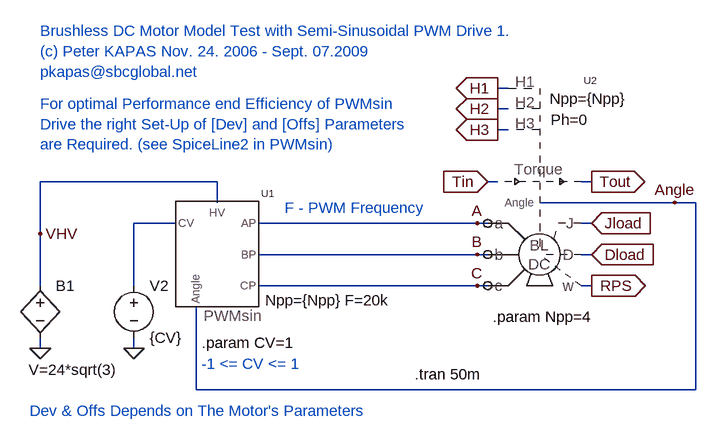
[diagram p0: schematic MotorTest02.asc]
MotorTest02.asc, the LTspice schematic file:
Version 4
SHEET 1 880 804
WIRE 80 -16 64 -16
WIRE 80 16 64 16
WIRE 80 48 64 48
WIRE -368 128 -640 128
WIRE 64 128 48 128
WIRE 208 128 192 128
WIRE -368 160 -368 128
WIRE 336 160 128 160
WIRE 368 160 336 160
WIRE -432 192 -496 192
WIRE 32 192 -304 192
WIRE 48 192 32 192
WIRE 208 192 192 192
WIRE -640 208 -640 128
WIRE 32 240 -304 240
WIRE 48 240 32 240
WIRE 208 240 192 240
WIRE -640 288 -640 208
WIRE -496 288 -496 192
WIRE 32 288 -304 288
WIRE 48 288 32 288
WIRE 208 288 192 288
WIRE -640 384 -640 368
WIRE -496 384 -496 368
WIRE -400 448 -400 320
WIRE 368 448 368 160
WIRE 368 448 -400 448
FLAG 336 160 Angle
FLAG 208 288 RPS
IOPIN 208 288 Out
FLAG 64 -16 H1
IOPIN 64 -16 Out
FLAG 64 16 H2
IOPIN 64 16 Out
FLAG 64 48 H3
IOPIN 64 48 Out
FLAG 208 128 Tout
IOPIN 208 128 Out
FLAG -496 384 0
FLAG 32 192 A
FLAG 32 240 B
FLAG 32 288 C
FLAG -640 384 0
FLAG -640 208 VHV
FLAG 48 128 Tin
IOPIN 48 128 In
FLAG 208 192 Jload
IOPIN 208 192 In
FLAG 208 240 Dload
IOPIN 208 240 In
SYMBOL voltage -496 272 R0
SYMATTR InstName V2
SYMATTR Value {CV}
SYMBOL bv -640 272 R0
WINDOW 3 -18 145 Left 0
SYMATTR Value V=24*sqrt(3)
SYMATTR InstName B1
SYMBOL TDRIVER -352 240 R0
SYMATTR SpiceLine Npp={Npp} F=20k
SYMATTR InstName U1
SYMBOL BLDC 128 240 R0
SYMATTR SpiceLine Ph=0
SYMATTR InstName U2
TEXT -640 -104 Left 0 ;Brushless DC Motor Model Test with Semi-Sinusoidal PWM Drive 1.\n(c) Peter KAPAS Nov. 24. 2006 - Sept. 07.2009\npkapas@sbcglobal.net
TEXT -64 424 Left 0 !.tran 50m
TEXT -392 376 Left 0 !.param CV=1
TEXT -392 408 Left 0 ;-1 <= CV <= 1
TEXT 56 336 Left 0 !.param Npp=4
TEXT -640 8 Left 0 ;For optimal Performance end Efficiency of PWMsin \nDrive the right Set-Up of [Dev] and [Offs] Parameters\nare Required. (see SpiceLine2 in PWMsin)
TEXT -264 168 Left 0 ;F - PWM Frequency
TEXT -656 480 Left 0 ;Dev & Offs Depends on The Motor's Parameters

The netlist it stands for:
* MotorTest02.asc
V2 N001 0 {CV}
B1 VHV 0 V=24*sqrt(3)
XU1 N001 Angle A B C VHV TDriver Npp={Npp} F=20k Dev=0.7549 Offs=0.0829  ; pins CV Angle AP BP CP HV
XU2 A B C Jload Dload Tin Tout RPS Angle H1 H2 H3 BLDC Npp={Npp} Ph=0  ; pins A B C LoadInertia LoadDump Tin Tout W Angle H1 H2 H3
* Brushless DC Motor Model Test with Semi-Sinusoidal PWM Drive 1.
* (c) Peter KAPAS Nov. 24. 2006 - Sept. 07.2009
* pkapas@sbcglobal.net
.tran 50m
.param CV=1
* -1 <= CV <= 1
.param Npp=4
* For optimal Performance end Efficiency of PWMsin
* Drive the right Set-Up of [Dev] and [Offs] Parameters
* are Required. (see SpiceLine2 in PWMsin)
* F - PWM Frequency
* Dev & Offs Depends on The Motor's Parameters
.lib BLDCSupport.lib
.lib BLDC.Lib
.backanno
.end